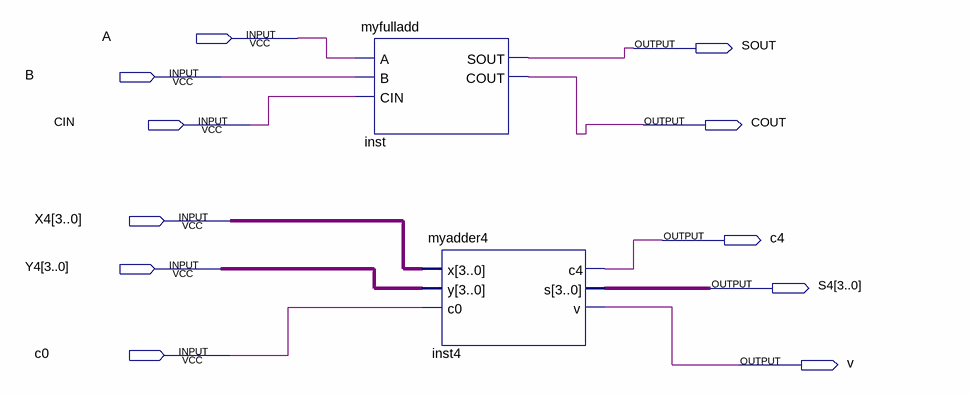
[diagram p0: schematic sheet]
// Quartus schematic Lab5.bdf as structural Verilog: 2 symbols, 11 pins
module Lab5 (
  input  A,
  input  B,
  input  CIN,
  input  [3:0] X4,
  input  [3:0] Y4,
  input  c0,
  output SOUT,
  output COUT,
  output c4,
  output [3:0] S4,
  output v
);

  myfulladd inst (.A(A), .B(B), .CIN(CIN), .SOUT(SOUT), .COUT(COUT));
  myadder4 inst4 (.x(X4), .y(Y4), .c0(c0), .c4(c4), .s(S4), .v(v));
endmodule
